# Altium schematic sheet Arduino_Uno_V1.0.SchDoc (part 1 of 3)
size A2
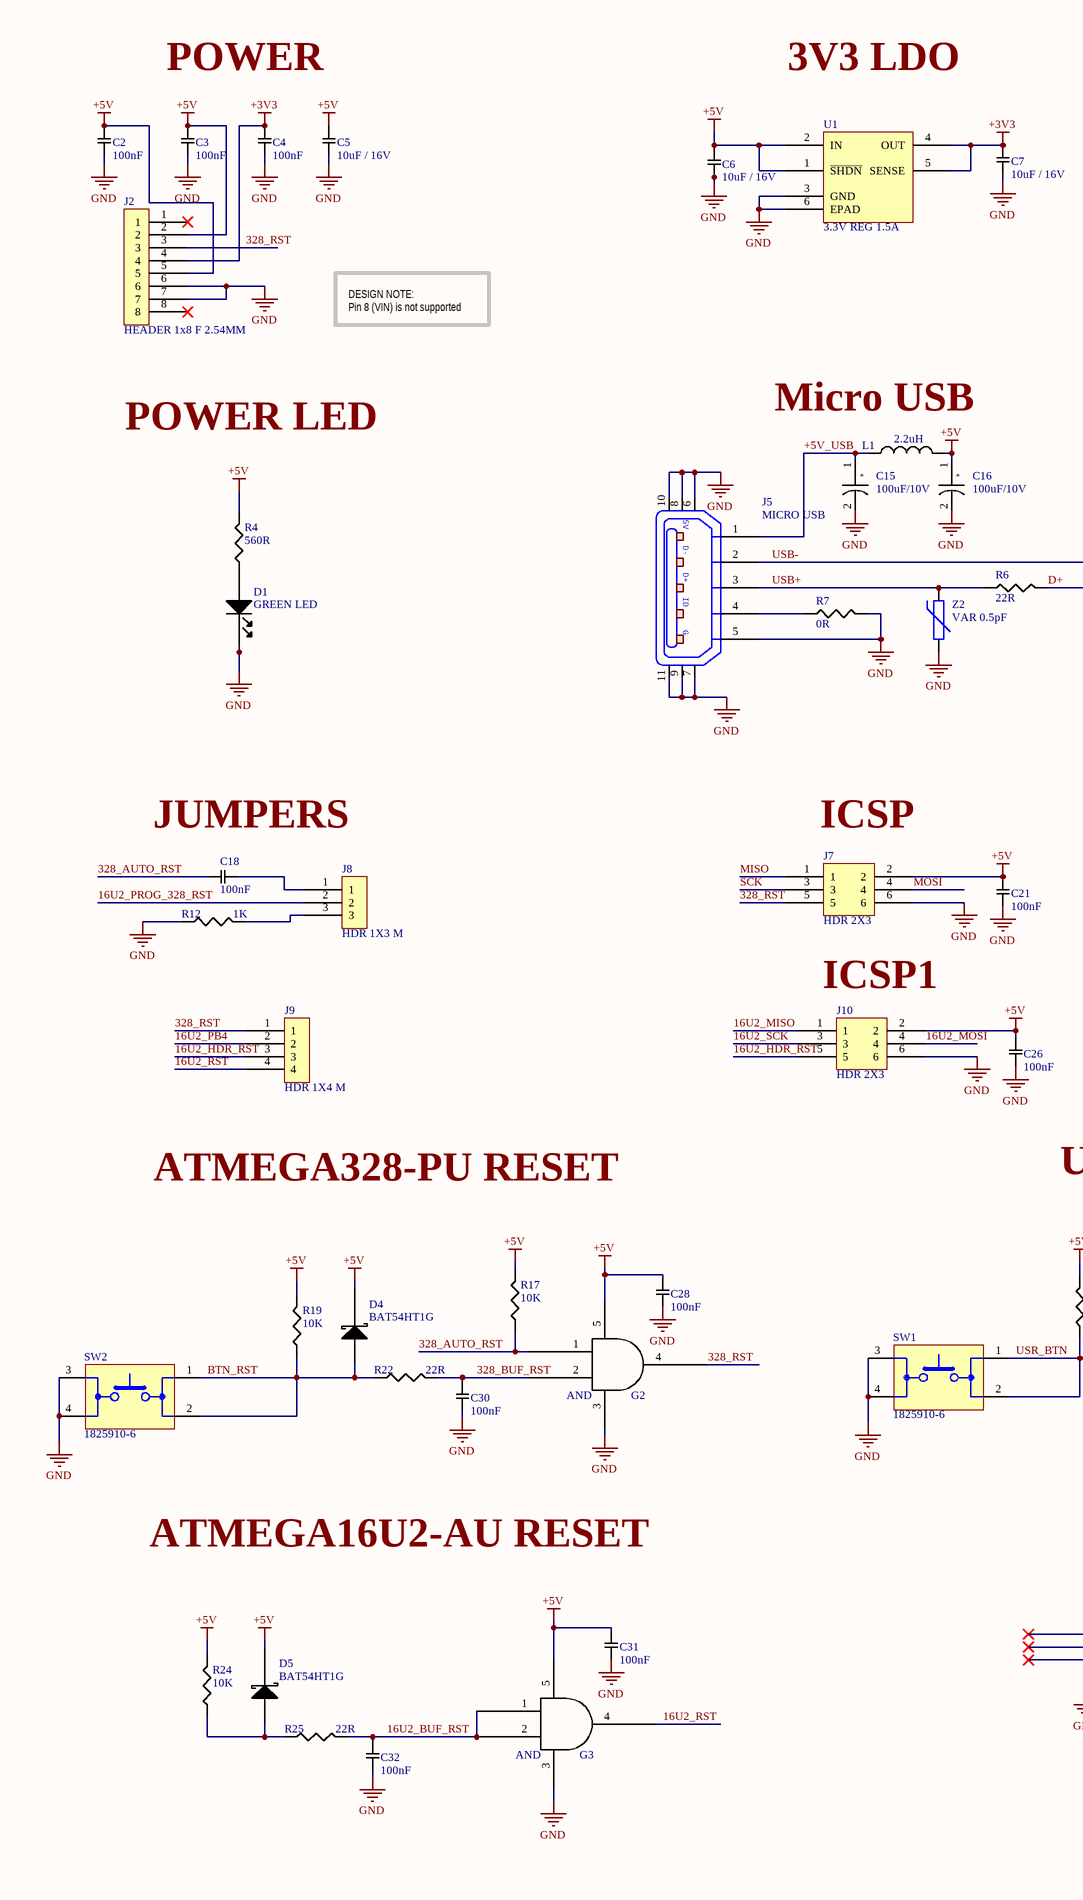
[diagram p0: Arduino_Uno_V1.0.SchDoc, left]
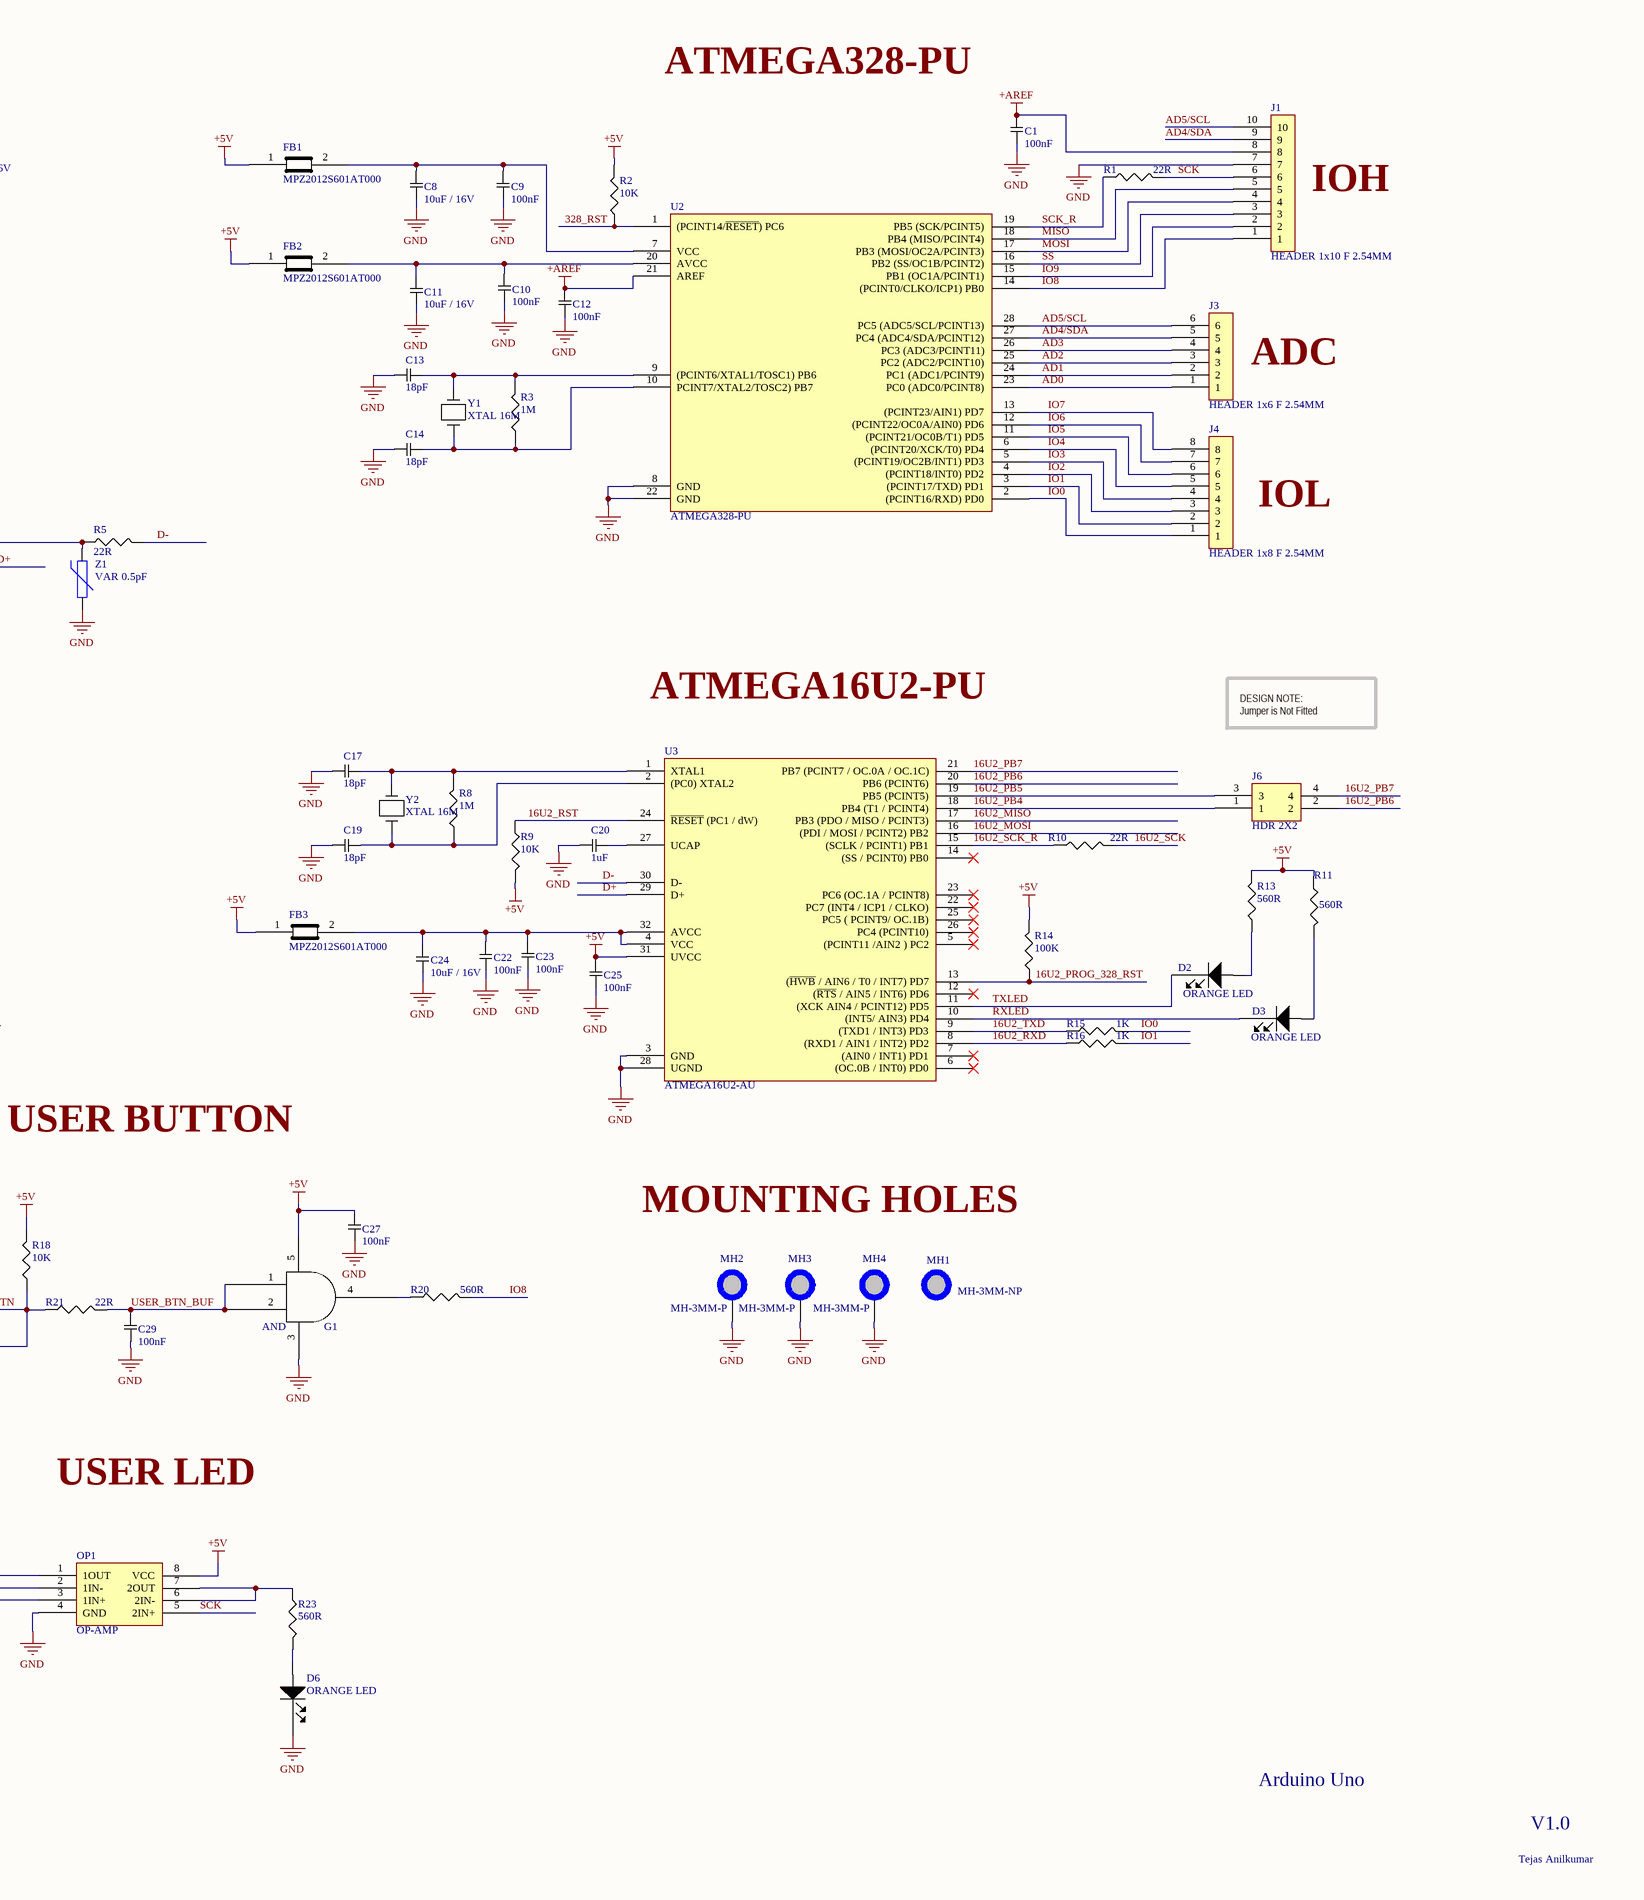
[diagram p1: Arduino_Uno_V1.0.SchDoc, right]

## Parts
C1  100nF  [C0805]
C2  100nF  [C0805]
C3  100nF  [C0805]
C4  100nF  [C0805]
C5  10uF / 16V  [C0805]
C6  10uF / 16V  [C0805]
C7  10uF / 16V  [C0805]
C8  10uF / 16V  [C0805]
C9  100nF  [C0805]
C10  100nF  [C0805]
C11  10uF / 16V  [C0805]
C12  100nF  [C0805]
C13  18pF  [C0805]
C14  18pF  [C0805]
C15  100uF/10V  [CAP-ALUM]
C16  100uF/10V  [CAP-ALUM]
C17  18pF  [C0805]
C18  100nF  [C0805]
C19  18pF  [C0805]
C20  1uF  [C0805]
C21  100nF  [C0805]
C22  100nF  [C0805]
C23  100nF  [C0805]
C24  10uF / 16V  [C0805]
C25  100nF  [C0805]
C26  100nF  [C0805]
C27  100nF  [C0805]
C28  100nF  [C0805]
C29  100nF  [C0805]
C30  100nF  [C0805]
C31  100nF  [C0805]
C32  100nF  [C0805]
D1  GREEN LED  [LED_0603_GR]
D2  ORANGE LED  [LED_0603_OR]
D3  ORANGE LED  [LED_0603_OR]
D4  BAT54HT1G  [SOD323]
D5  BAT54HT1G  [SOD323]
D6  ORANGE LED  [LED_0603_OR]
FB1  MPZ2012S601AT000  [FERRITE-BEAD-0805]
FB2  MPZ2012S601AT000  [FERRITE-BEAD-0805]
FB3  MPZ2012S601AT000  [FERRITE-BEAD-0805]
G1  AND  [SOT-23-5P]  (value not drawn)
G2  AND  [SOT-23-5P]  (value not drawn)
G3  AND  [SOT-23-5P]  (value not drawn)
J1  HEADER 1x10 F 2.54MM  [HEADER-10F2.54MM]
J2  HEADER 1x8 F 2.54MM  [HDR-1x8-F-2.54MM]
J3  HEADER 1x6 F 2.54MM  [HEADER-6PINF-2.54MM]
J4  HEADER 1x8 F 2.54MM  [HDR-1x8-F-2.54MM]
J5  MICRO USB  [MICRO-USB]
J6  HDR 2X2  [HDR-2X2-2.54MM]
J7  HDR 2X3  [BERGSTIK-2X3-2.54MM]
J8  HDR 1X3 M  [HDR 3P-M-2.54MM]
J9  HDR 1X4 M  [HDR 1x4 M]
J10  HDR 2X3  [BERGSTIK-2X3-2.54MM]
L1  2.2uH  [IND-1210]
MH1  MH-3MM-NP  [MH-3MM-NP]
MH2  MH-3MM-P  [MH-3MM]
MH3  MH-3MM-P  [MH-3MM]
MH4  MH-3MM-P  [MH-3MM]
OP1  OP-AMP  [SOP8]
R1  22R  [R0805]
R2  10K  [R0805]
R3  1M  [R0805]
R4  560R  [R0805]
R5  22R  [R0805]
R6  22R  [R0805]
R7  0R  [R0805]
R8  1M  [R0805]
R9  10K  [R0805]
R10  22R  [R0805]
R11  560R  [R0805]
R12  1K  [R0805]
R13  560R  [R0805]
R14  100K  [R0805]
R15  1K  [R0805]
R16  1K  [R0805]
R17  10K  [R0805]
R18  10K  [R0805]
R19  10K  [R0805]
R20  560R  [R0805]
R21  22R  [R0805]
R22  22R  [R0805]
R23  560R  [R0805]
R24  10K  [R0805]
R25  22R  [R0805]
SW1  1825910-6  [TAC-SW-6X6]
SW2  1825910-6  [TAC-SW-6X6]
U1  3.3V REG 1.5A  [LDO-DCQ]
U2  ATMEGA328-PU  [ATMEGA328-PU-DIP28 - duplicate]
U3  ATMEGA16U2-AU  [TQFP32]
Y1  XTAL 16M  [XTAL]
Y2  XTAL 16M  [XTAL]
Z1  VAR 0.5pF  [R0603]
Z2  VAR 0.5pF  [R0603]

## Nets
+3V3: C4.2 C7.2 J2.4 U1.4(OUT) U1.5(SENSE)
+5V: C2.2 C3.2 C5.2 C6.2 C16.1 C21.2 C25.2 C26.2 C27.2 C28.2 C31.2 D4.1(Cathode) D5.1(Cathode) FB1.1 FB2.1 FB3.1 G1.5(VCC) G2.5(VCC) G3.5(VCC) J2.2 J2.5 J7.2 J10.2 L1.2 OP1.8(VCC) R2.2 R4.2 R9.2 R11.1 R13.2 R14.2 R17.2 R18.2 R19.2 R24.2 U1.1(~{SHDN}) U1.2(IN) U3.31(UVCC)
+AREF: C1.2 C12.2 J1.8 U2.21(AREF)
GND: C1.1 C2.1 C3.1 C4.1 C5.1 C6.1 C7.1 C8.1 C9.1 C10.1 C11.1 C12.1 C13.1 C14.1 C15.2 C16.2 C17.1 C19.1 C20.1 C21.1 C22.1 C23.1 C24.1 C25.1 C26.1 C27.1 C28.1 C29.1 C30.1 C31.1 C32.1 D1.1(cathode) D6.1(cathode) G1.3(GND) G2.3(GND) G3.3(GND) J1.7 J2.6 J2.7 J5.5(P5) J5.6 J5.7 J5.8 J5.9 J5.10 J5.11 J7.6 J10.6 MH2.1 MH3.1 MH4.1 OP1.4(GND) R7.2 R12.1 SW1.3(MECH1) SW1.4(MECH2) SW2.3(MECH1) SW2.4(MECH2) U1.3(GND) U1.6(EPAD) U2.8(GND) U2.22(GND) U3.3(GND) U3.28(UGND) Z1.1 Z2.1
16U2_BUF_RST: C32.2 G3.1(A) G3.2(B) R25.2
16U2_HDR_RST: J9.3 J10.5
16U2_MISO: J10.1 U3.17(PB3_(PDO_/_MISO_/_PCINT3))
16U2_MOSI: J10.4 U3.16((PDI_/_MOSI_/_PCINT2)_PB2)
16U2_PB4: J6.1 J9.2 U3.18(PB4_(T1_/_PCINT4))
16U2_PB5: J6.3 U3.19(PB5_(PCINT5))
16U2_PB6: J6.2 U3.20(PB6_(PCINT6))
16U2_PB7: J6.4 U3.21(PB7_(PCINT7_/_OC.0A_/_OC.1C))
16U2_PROG_328_RST: J8.2 R14.1 U3.13((~{HWB}_/_AIN6_/_T0_/_INT7)_PD7)
16U2_RST: G3.4(Y) J9.4 R9.1 U3.24(~{RESET}_(PC1_/_dW))
16U2_RXD: R16.1 U3.8((RXD1_/_AIN1_/_INT2)_PD2)
16U2_SCK: J10.3 R10.2
16U2_SCK_R: R10.1 U3.15((SCLK_/_PCINT1)_PB1)
16U2_TXD: R15.1 U3.9((TXD1_/_INT3)_PD3)
328_AUTO_RST: C18.2 G2.1(A) R17.1
328_BUF_RST: C30.2 G2.2(B) R22.2
328_RST: G2.4(Y) J2.3 J7.5 J9.1 R2.1 U2.1((PCINT14/~{RESET})_PC6)
+5V_USB: C15.1 J5.1(P1) L1.1
AD0: J3.1 U2.23(PC0_(ADC0/PCINT8))
AD1: J3.2 U2.24(PC1_(ADC1/PCINT9))
AD2: J3.3 U2.25(PC2_(ADC2/PCINT10))
AD3: J3.4 U2.26(PC3_(ADC3/PCINT11))
AD4/SDA: J1.9 J3.5 U2.27(PC4_(ADC4/SDA/PCINT12))
AD5/SCL: J1.10 J3.6 U2.28(PC5_(ADC5/SCL/PCINT13))
BTN_RST: D4.2(Anode) R19.1 R22.1 SW2.1 SW2.2
D+: R6.2 U3.29(D+)
D-: R5.2 U3.30(D-)
IO0: J4.1 R15.2 U2.2((PCINT16/RXD)_PD0)
IO1: J4.2 R16.2 U2.3((PCINT17/TXD)_PD1)
IO2: J4.3 U2.4((PCINT18/INT0)_PD2)
IO3: J4.4 U2.5((PCINT19/OC2B/INT1)_PD3)
IO4: J4.5 U2.6((PCINT20/XCK/T0)_PD4)
IO5: J4.6 U2.11((PCINT21/OC0B/T1)_PD5)
IO6: J4.7 U2.12((PCINT22/OC0A/AIN0)_PD6)
IO7: J4.8 U2.13((PCINT23/AIN1)_PD7)
IO8: J1.1 R20.2 U2.14((PCINT0/CLKO/ICP1)_PB0)
IO9: J1.2 U2.15(PB1_(OC1A/PCINT1))
MISO: J1.5 J7.1 U2.18(PB4_(MISO/PCINT4))
MOSI: J1.4 J7.4 U2.17(PB3_(MOSI/OC2A/PCINT3))
RXLED: D3.1(cathode) U3.10((INT5/_AIN3)_PD4)
SCK: J1.6 J7.3 OP1.5(2IN+) R1.2
SCK_R: R1.1 U2.19(PB5_(SCK/PCINT5))
SS: J1.3 U2.16(PB2_(SS/OC1B/PCINT2))
TXLED: D2.1(cathode) U3.11((XCK_AIN4_/_PCINT12)_PD5)
USB+: J5.3(P3) R6.1 Z2.2
USB-: J5.2(P2) R5.1 Z1.2
USER_BTN_BUF: C29.2 G1.1(A) G1.2(B) R21.2
USR_BTN: R18.1 R21.1 SW1.1 SW1.2
NetC8_2: C8.2 C9.2 FB1.2 U2.7(VCC)
NetC10_2: C10.2 C11.2 FB2.2 U2.20(AVCC)
NetC13_2: C13.2 R3.2 U2.9((PCINT6/XTAL1/TOSC1)_PB6) Y1.2
NetC14_2: C14.2 R3.1 U2.10(PCINT7/XTAL2/TOSC2)_PB7) Y1.1
NetC17_2: C17.2 R8.2 U3.1(XTAL1) Y2.2
NetC18_1: C18.1 J8.1
NetC19_2: C19.2 R8.1 U3.2((PC0)_XTAL2) Y2.1
NetC20_2: C20.2 U3.27(UCAP)
NetC22_2: C22.2 C23.2 C24.2 FB3.2 U3.4(VCC) U3.32(AVCC)
NetD1_2: D1.2(ANODE) R4.1
NetD2_2: D2.2(ANODE) R13.1
NetD3_2: D3.2(ANODE) R11.2
NetD5_2: D5.2(Anode) R24.1 R25.1
NetD6_2: D6.2(ANODE) R23.2
NetG1_4: G1.4(Y) R20.1
NetJ5_4: J5.4(P4) R7.1
NetJ8_3: J8.3 R12.2
NetOP1_6: OP1.6(2IN-) OP1.7(2OUT) R23.1

Not connected (* = marked no-connect by the designer): J2 1* 8*; OP1 1(1OUT)* 2(1IN-)* 3(1IN+)*; U3 5((PCINT11_/AIN2_)_PC2)* 6((OC.0B_/_INT0)_PD0)* 7((AIN0_/_INT1)_PD1)* 12((~{RTS}_/_AIN5_/_INT6)_PD6)* 14((SS_/_PCINT0)_PB0)* 22(PC7_(INT4_/_ICP1_/_CLKO))* 23(PC6_(OC.1A_/_PCINT8))* 25(PC5_(_PCINT9/_OC.1B))* 26(PC4_(PCINT10))*

## Notes on the sheet
- POWER
- 3V3 LDO
- ATMEGA328-PU
- IOH
- DESIGN NOTE:
  Pin 8 (VIN) is not supported
- ADC
- POWER LED
- Micro USB
- IOL
- ATMEGA16U2-PU
- DESIGN NOTE:
  Jumper is Not Fitted
- JUMPERS
- (near J7) ICSP
- ICSP1
- ATMEGA328-PU RESET
- USER BUTTON
- MOUNTING HOLES
- USER LED
- ATMEGA16U2-AU RESET
- Arduino Uno
- Tejas Anilkumar
- V1.0
- (in symbol 10118193-0001LF) 5V; D-; D+; ID; G
- (in symbol EEE-1AA101WR) +